# EAGLE design ORing_block (EAGLE 8.1.0)
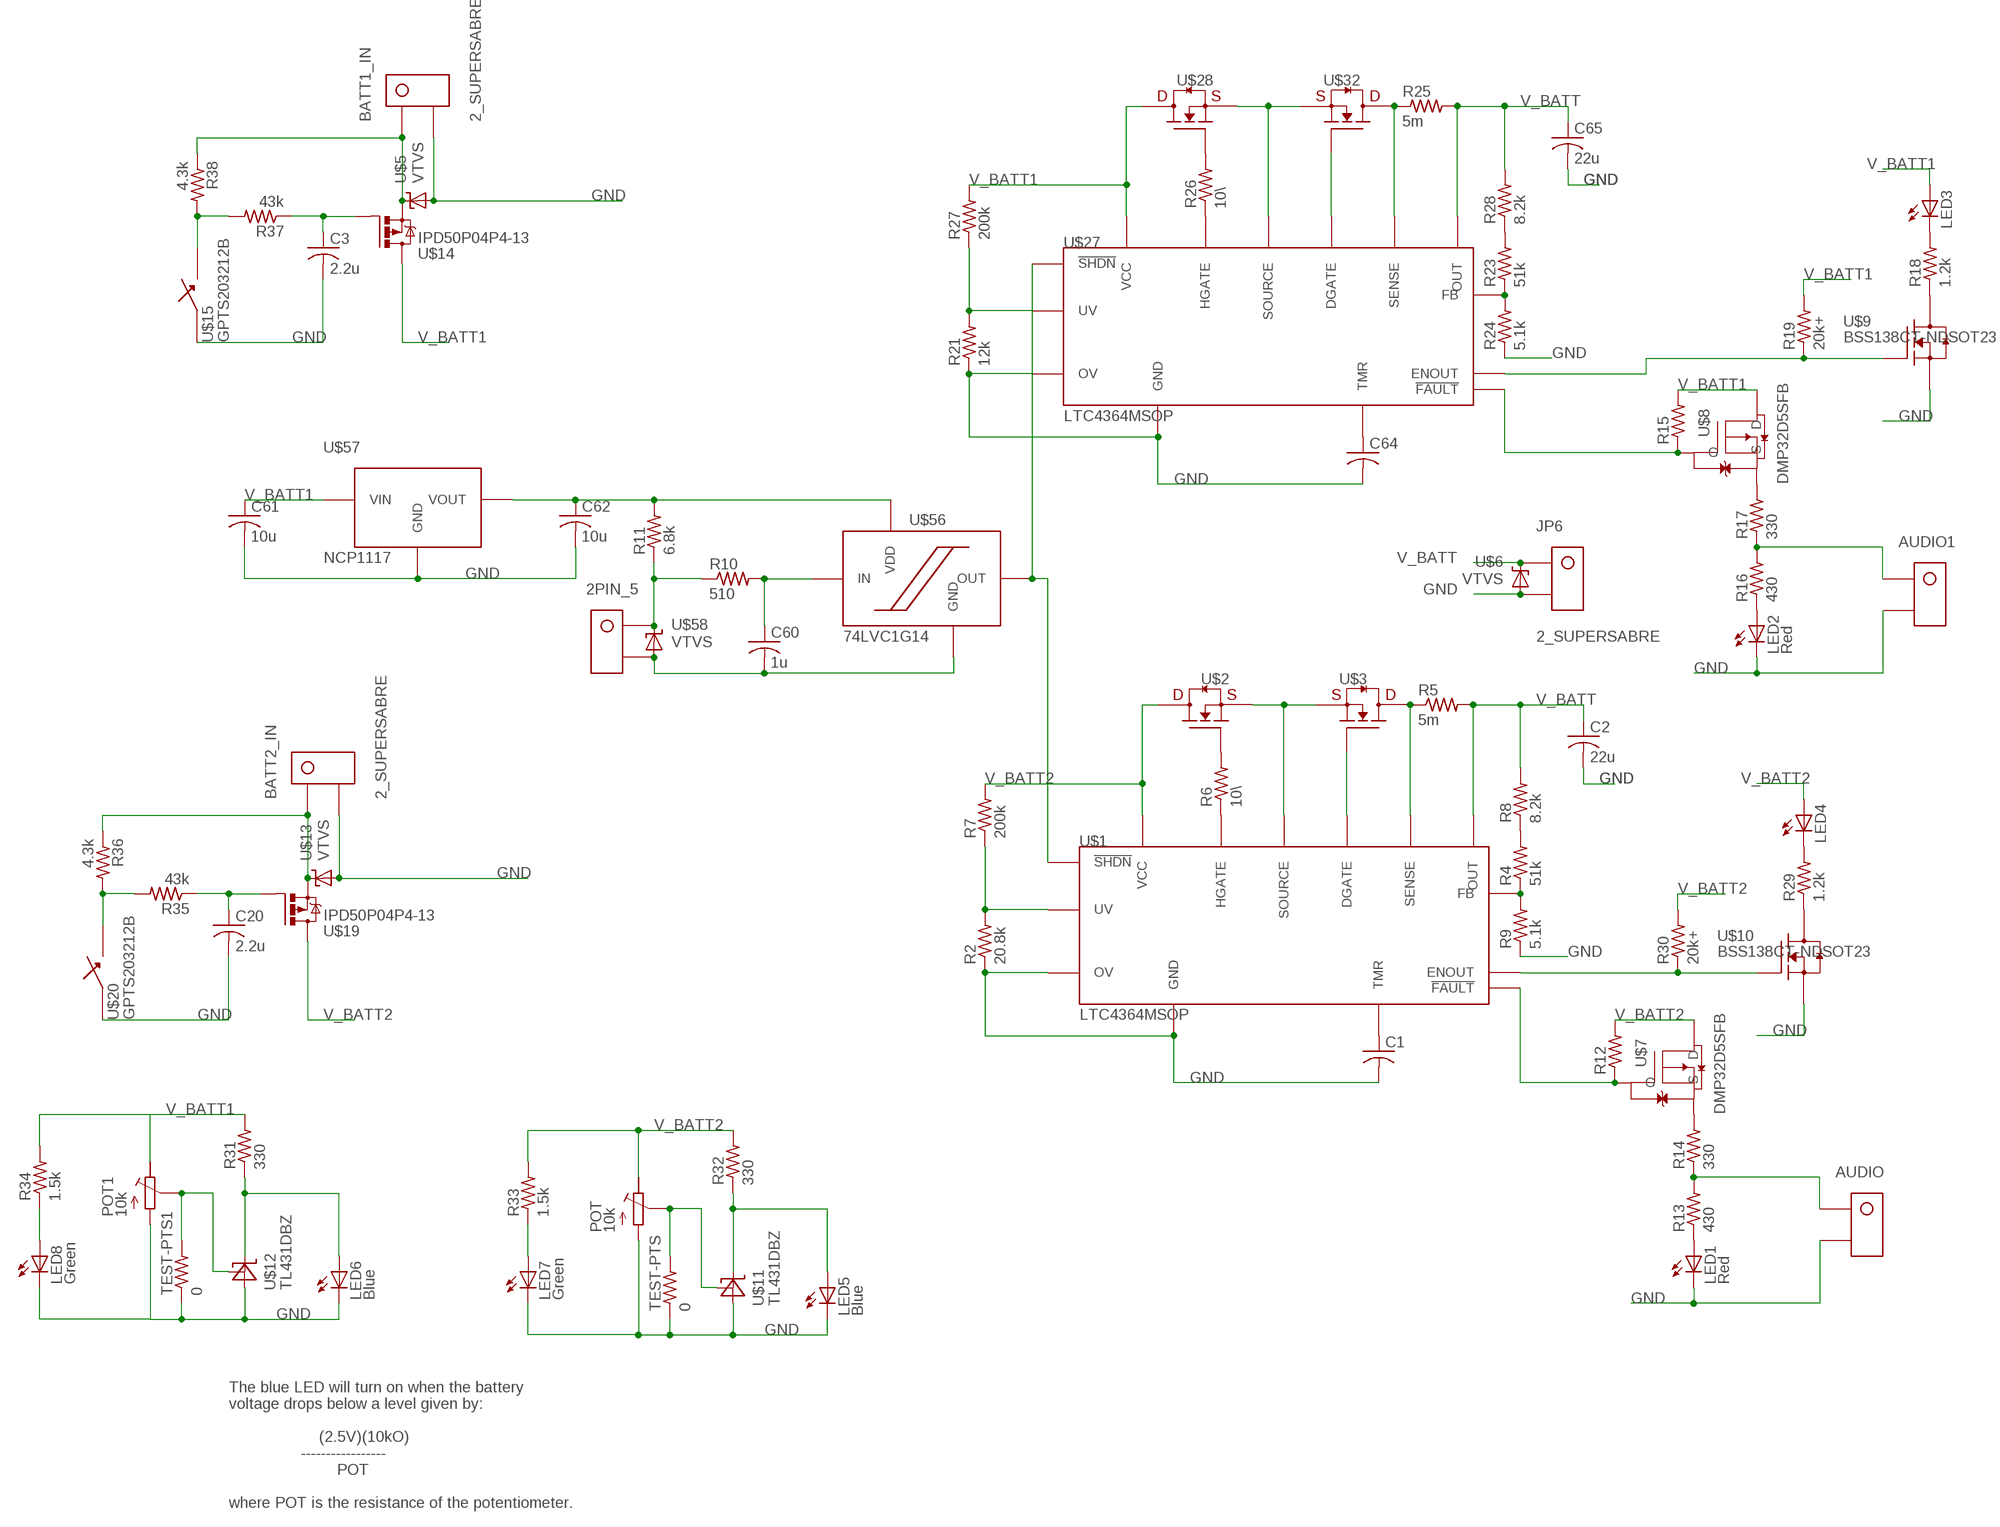
[diagram p0: schematic, sheet 1]

## Parts
2PIN_5  KK254_VERT_2PIN22-29-2021  [KK254_VERT_2PIN]
AUDIO  KK254_VERT_2PIN22-29-2021  [KK254_VERT_2PIN]
AUDIO1  KK254_VERT_2PIN22-29-2021  [KK254_VERT_2PIN]
BATT1_IN  2_SUPERSABRE  [SUPERSABRE_2CIRCUIT]
BATT2_IN  2_SUPERSABRE  [SUPERSABRE_2CIRCUIT]
C1  C-USC0805  [C0805]
C2  22u  C-USC0805  [C0805]
C3  2.2u  C-USC0805  [C0805]
C20  2.2u  C-USC0805  [C0805]
C60  1u  C-USC0805  [C0805]
C61  10u  C-USC0805  [C0805]
C62  10u  C-USC0805  [C0805]
C64  C-USC0805  [C0805]
C65  22u  C-USC0805  [C0805]
JP6  2_SUPERSABRE  [SUPERSABRE_2CIRCUIT]
LED1  Red  LEDCHIPLED_0805  [CHIPLED_0805]
LED2  Red  LEDCHIPLED_0805  [CHIPLED_0805]
LED3  LEDCHIPLED_0805  [CHIPLED_0805]
LED4  LEDCHIPLED_0805  [CHIPLED_0805]
LED5  Blue  0805_LED  [0805]
LED6  Blue  0805_LED  [0805]
LED7  Green  0805_LED  [0805]
LED8  Green  0805_LED  [0805]
POT  10k  R-TRIMMPTV09A-4  [PTV09A-4]
POT1  10k  R-TRIMMPTV09A-4  [PTV09A-4]
R2  20.8k  R-US_R0805  [R0805]
R4  51k  R-US_R0805  [R0805]
R5  5m  R-US_R0805  [R0805]
R6  10\  R-US_R0805  [R0805]
R7  200k  R-US_R0805  [R0805]
R8  8.2k  R-US_R0805  [R0805]
R9  5.1k  R-US_R0805  [R0805]
R10  510  R-US_R0805  [R0805]
R11  6.8k  R-US_R0805  [R0805]
R12  R-US_R0805  [R0805]
R13  430  R-US_R0805  [R0805]
R14  330  R-US_R0805  [R0805]
R15  R-US_R0805  [R0805]
R16  430  R-US_R0805  [R0805]
R17  330  R-US_R0805  [R0805]
R18  1.2k  R-US_R0805  [R0805]
R19  20k+  R-US_R0805  [R0805]
R21  12k  R-US_R0805  [R0805]
R23  51k  R-US_R0805  [R0805]
R24  5.1k  R-US_R0805  [R0805]
R25  5m  R-US_R0805  [R0805]
R26  10\  R-US_R0805  [R0805]
R27  200k  R-US_R0805  [R0805]
R28  8.2k  R-US_R0805  [R0805]
R29  1.2k  R-US_R0805  [R0805]
R30  20k+  R-US_R0805  [R0805]
R31  330  R-US_R0805  [R0805]
R32  330  R-US_R0805  [R0805]
R33  1.5k  R-US_R0805  [R0805]
R34  1.5k  R-US_R0805  [R0805]
R35  43k  R-US_R0805  [R0805]
R36  4.3k  R-US_R0805  [R0805]
R37  43k  R-US_R0805  [R0805]
R38  4.3k  R-US_R0805  [R0805]
TEST-PTS  0  R-US_V526-0  [V526-0]
TEST-PTS1  0  R-US_V526-0  [V526-0]
U$1  LTC4364MSOP  [MSOP16]
U$2  FDMC8360LET40PWR33  [POWER33]
U$3  FDMC8360LET40PWR33  [POWER33]
U$5  VTVS  [DO-219AB]
U$6  VTVS  [DO-219AB]
U$7  DMP32D5SFB  [AP02002]
U$8  DMP32D5SFB  [AP02002]
U$9  BSS138CT-NDSOT23  [SOT23]
U$10  BSS138CT-NDSOT23  [SOT23]
U$11  TL431DBZ  [SOT-23-3]
U$12  TL431DBZ  [SOT-23-3]
U$13  VTVS  [DO-219AB]
U$14  IPD50P04P4-13  [TO252-3]
U$15  GPTS203212B  [GPTS203211B]
U$19  IPD50P04P4-13  [TO252-3]
U$20  GPTS203212B  [GPTS203211B]
U$27  LTC4364MSOP  [MSOP16]
U$28  FDMC8360LET40PWR33  [POWER33]
U$32  FDMC8360LET40PWR33  [POWER33]
U$56  74LVC1G14  [TSSOP5]
U$57  NCP1117  [SOT-223]
U$58  VTVS  [DO-219AB]

## Nets
GND: AUDIO1.P$2 AUDIO.P$2 BATT1_IN.P$2 BATT2_IN.P$2 C1.2 C2.2 C3.2 C20.2 C61.2 C62.2 C64.2 C65.2 JP6.P$2 LED1.C LED2.C LED5.P$2(C) LED6.P$2(C) LED7.P$2(C) LED8.P$2(C) POT1.P$3(E) POT.P$3(E) R2.1 R9.1 R21.1 R24.1 TEST-PTS1.1 TEST-PTS.1 U$1.GND U$1.OV U$5.P$1(A) U$6.P$1(A) U$9.2(S) U$10.2(S) U$11.P$3(A) U$12.P$3(A) U$13.P$1(A) U$15.P$1 U$20.P$1 U$27.GND U$27.OV U$57.P$1(GND)
N$1: R2.2 R7.1 U$1.UV
N$3: R4.1 R9.2 U$1.FB
N$4: R6.1 U$1.HGATE
N$6: C1.1 U$1.TMR
N$7: R4.2 R8.1
N$8: R6.2 U$2.GATE
N$9: U$1.SOURCE U$2.SOURCE1(SOURCE) U$2.SOURCE2(SOURCE) U$2.SOURCE3(SOURCE) U$3.SOURCE1(SOURCE) U$3.SOURCE2(SOURCE) U$3.SOURCE3(SOURCE)
N$10: R5.1 U$1.SENSE U$3.DRAIN
N$11: U$1.DGATE U$3.GATE
N$12: 2PIN_5.P$1 R10.1 R11.1 U$58.P$2(C)
N$13: C62.1 R11.2 U$56.P$5(VDD) U$57.P$2(VOUT) U$57.P$4(VOUT)
N$14: U$1.SHDN(!SHDN!) U$27.SHDN(!SHDN!) U$56.P$4(OUT)
N$15: R14.2 U$7.P$1(S)
N$16: LED1.A R13.1
N$17: R12.1 U$1.FLT(!FAULT!) U$7.P$2(G)
N$18: AUDIO.P$1 R13.2 R14.1
N$19: LED2.A R16.1
N$20: R15.1 U$8.P$2(G) U$27.FLT(!FAULT!)
N$21: R17.2 U$8.P$1(S)
N$22: AUDIO1.P$1 R16.2 R17.1
N$23: POT.P$2(S) TEST-PTS.2 U$11.P$2(REF)
N$24: R18.1 U$9.3(D)
N$25: LED3.C R18.2
N$26: R29.1 U$10.3(D)
N$27: LED4.C R29.2
N$28: R30.1 U$1.ENOUT U$10.1(G)
N$29: R19.1 U$9.1(G) U$27.ENOUT
N$30: LED5.P$1(A) R32.1 U$11.P$1(C)
N$31: POT1.P$2(S) TEST-PTS1.2 U$12.P$2(REF)
N$32: LED6.P$1(A) R31.1 U$12.P$1(C)
N$33: LED7.P$1(A) R33.1
N$34: LED8.P$1(A) R34.1
N$35: C20.1 R35.1 U$19.1(G)
N$36: R35.2 R36.2 U$20.P$2
N$37: R26.1 U$27.HGATE
N$38: BATT1_IN.P$1 R38.1 U$5.P$2(C) U$14.TAB(D)
N$39: R21.2 R27.1 U$27.UV
N$40: C3.1 R37.1 U$14.1(G)
N$41: R37.2 R38.2 U$15.P$2
N$45: BATT2_IN.P$1 R36.1 U$13.P$2(C) U$19.TAB(D)
N$48: 2PIN_5.P$2 C60.2 U$56.P$3(GND) U$58.P$1(A)
N$49: C60.1 R10.2 U$56.P$2(IN)
N$50: R23.1 R24.2 U$27.FB
N$53: C64.1 U$27.TMR
N$54: U$27.SOURCE U$28.SOURCE1(SOURCE) U$28.SOURCE2(SOURCE) U$28.SOURCE3(SOURCE) U$32.SOURCE1(SOURCE) U$32.SOURCE2(SOURCE) U$32.SOURCE3(SOURCE)
N$57: R23.2 R28.1
N$59: R26.2 U$28.GATE
N$60: R25.1 U$27.SENSE U$32.DRAIN
N$61: U$27.DGATE U$32.GATE
V_BATT: C2.1 C65.1 JP6.P$1 R5.2 R8.2 R25.2 R28.2 U$1.OUT U$6.P$2(C) U$27.OUT
V_BATT1: C61.1 LED3.A POT1.P$1(A) R15.2 R19.2 R27.2 R31.2 R34.2 U$8.P$3(D) U$14.3(S) U$27.VCC U$28.DRAIN U$57.P$3(VIN)
V_BATT2: LED4.A POT.P$1(A) R7.2 R12.2 R30.2 R32.2 R33.2 U$1.VCC U$2.DRAIN U$7.P$3(D) U$19.3(S)

## Notes on the sheet
- The blue LED will turn on when the battery
  voltage drops below a level given by:
  
                      (2.5V)(10kO)
                  -----------------
                          POT
  
  where POT is the resistance of the potentiometer.

## Library data of the parts
2PIN_5 AUDIO AUDIO1 = molex:KK254_VERT_2PIN: KK® 254 Wire-to-Board Header, Vertical, with Friction Lock, 2 Circuits, Gold (Au) Plating Part Number: 22-29-2021 http://www.molex.com/molex/products/datasheet.jsp?part=active/0022292021_PCB_HEADERS.xml
BATT1_IN BATT2_IN JP6 = molex:2_SUPERSABRE: Molex SuperSabre 2-pin vertical header
C1-C3 C20 C60-C62 C64 C65 = resistor:C-US: CAPACITOR, American symbol
LED1-LED4 = led:LED: LED OSRAM: - CHIPLED LG R971, LG N971, LY N971, LG Q971, LY Q971, LO R971, LY R971 LH N974, LH R974 LS Q976, LO Q976, LY Q976 LO Q996 - Hyper CHIPLED LW Q18S LB Q993, LB Q99A, LB R99A - SideLED LS A670, LO A670, LY A670, LG A670, LP A670 LB A673, LV A673, LT A673, LW A673 LH A674 LY A675 LS A676, LA A676, LO A676, LY A676, LW A676 LS A679, LY A679, LG A679 - Hyper Micro SIDELED® LS Y876, LA Y876, LO Y876, LY Y876 LT Y87S - SmartLED LW L88C, LW L88S LB L89C, LB L89S, LG L890 LS L89K, LO L89K, LY L89K LS L896, LA L896, LO L896, LY L896 - TOPLED LS T670, LO T670, LY T670, LG T670, LP T670 LSG T670, LSP T670, LSY T670, LOP T670, LYG T670 LG T671, LOG T671, LSG T671 LB T673, LV T673, LT T673, LW T673 LH T674 LS T676, LA T676, LO T676, LY T676, LB T676, LH T676, LSB T676, LW T676 LB T67C, LV T67C, LT T67C, LS T67K, LO T67K, LY T67K, LW E67C LS E67B, LA E67B, LO E67B, LY E67B, LB E67C, LV E67C, LT E67C LW T67C LS T679, LY T679, LG T679 LS T770, LO T770, LY T770, LG T770, LP T770 LB T773, LV T773, LT T773, LW T773 LH T774 LS E675, LA E675, LY E675, LS T675 LS T776, LA T776, LO T776, LY T776, LB T776 LHGB T686 LT T68C, LB T68C - Hyper Mini TOPLED® LB M676 - Mini TOPLED Santana® LG M470 LS M47K, LO M47K, LY M47K Source: http://www.osram.convergy.de LUXEON: - LUMILED® LXK2-PW12-R00, LXK2-PW12-S00, LXK2-PW14-U00, LXK2-PW14-V00 LXK2-PM12-R00, LXK2-PM12-S00, LXK2-PM14-U00 LXK2-PE12-Q00, LXK2-PE12-R00, LXK2-PE12-S00, LXK2-PE14-T00, LXK2-PE14-U00 LXK2-PB12-K00, LXK2-PB12-L00, LXK2-PB12-M00, LXK2-PB14-N00, LXK2-PB14-P00, LXK2-PB14-Q00 LXK2-PR12-L00, LXK2-PR12-M00, LXK2-PR14-Q00, LXK2-PR14-R00 LXK2-PD12-Q00, LXK2-PD12-R00, LXK2-PD12-S00 LXK2-PH12-R00, LXK2-PH12-S00 LXK2-PL12-P00, LXK2-PL12-Q00, LXK2-PL12-R00 Source: www.luxeon.com KINGBRIGHT: KA-3528ASYC Source: www.kingbright.com
LED5-LED8 = led:0805_LED: LED, 0805 package. Any variety.
POT POT1 = resistor:R-TRIMM: Trimm resistor
R2 R4-R19 R21 R23-R38 TEST-PTS TEST-PTS1 = resistor:R-US_: RESISTOR, American symbol
U$1 U$27 = linear:LTC4364
U$2 U$3 U$28 U$32 = fairchild:FDMC8360LET40
U$5 U$6 U$13 U$58 = diode:VTVS: Vishay VTVS5V0ASMF to VTVS63GSMF 400W TVS diodes Datasheet <http://www.mouser.com/ds/2/427/vtvs5v0asmf-1078013.pdf>
U$7 U$8 = transistor-fet:DMP32D5SFB: Diodes Inc. DMP32D5SFB 30V P-MOSFET (Enhancement) Datasheet <http://www.mouser.com/ds/2/115/DMP32D5SFB-765036.pdf>
U$9 U$10 = transistor-fet:BSS138CT-ND: ON Semiconductor BSS138 N-MOSFET, Logic Level Datasheet <http://www.mouser.com/ds/2/149/BSS138-1006682.pdf>
U$11 U$12 = texas:TL431: Texas Instruments TL431 Adjustable shunt regulator Datasheet <http://www.ti.com/lit/ds/symlink/tl431.pdf>
U$14 U$19 = transistor-power:IPD50P04P4-13: Infineon IPD50P04P4-13 OptiMOS®-P2 Power-Transistor Datasheet <http://www.mouser.com/ds/2/196/Infineon-IPD50P04P4-13-DS-v01_02-EN-336147.pdf>
U$15 U$20 = switches:GPTS203212B: CW Industries Pushbutton SPST switch ON-OFF, 1A, 30VDC Datasheet <http://switches-connectors-custom.cwind.com/Asset/GPTS203211BR2.pdf>
U$56 = NXP:74LVC1G14: Nexperia 74LVC1G14 Single Schmitt trigger inverter Datasheet <http://www.mouser.com/ds/2/302/74LVC1G14_Q100-839654.pdf>
U$57 = ONSemi:NCP1117: ON Semiconductor NCP1117 5V 1A Fixed LDO Datasheet <http://www.mouser.com/ds/2/308/NCP1117-D-81326.pdf>

## Board
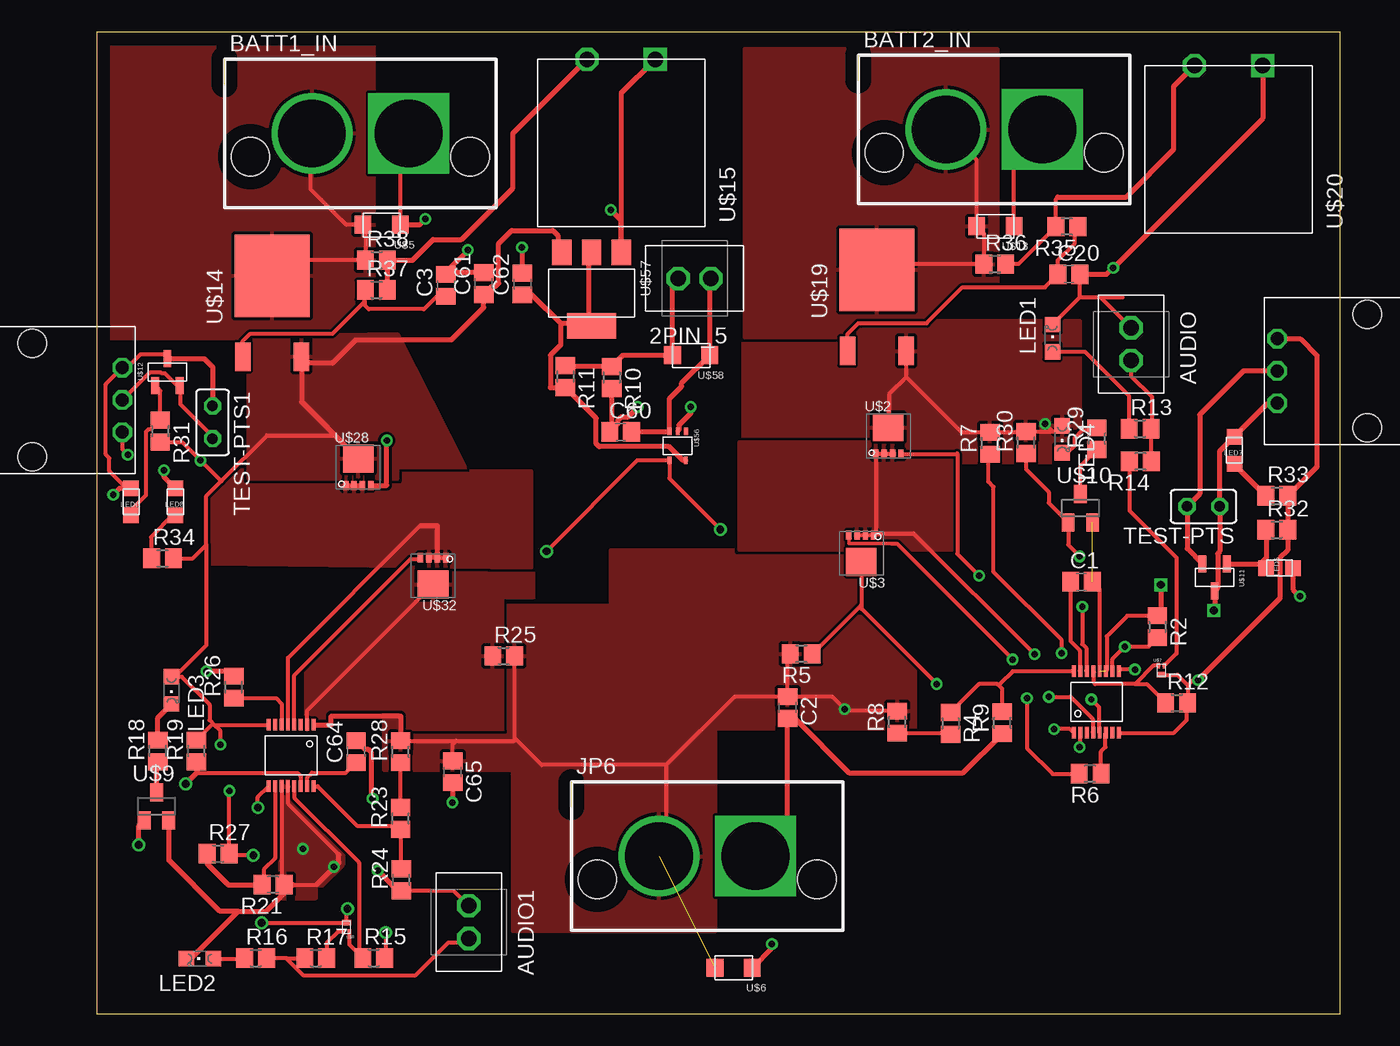
[diagram p1: board, top side]
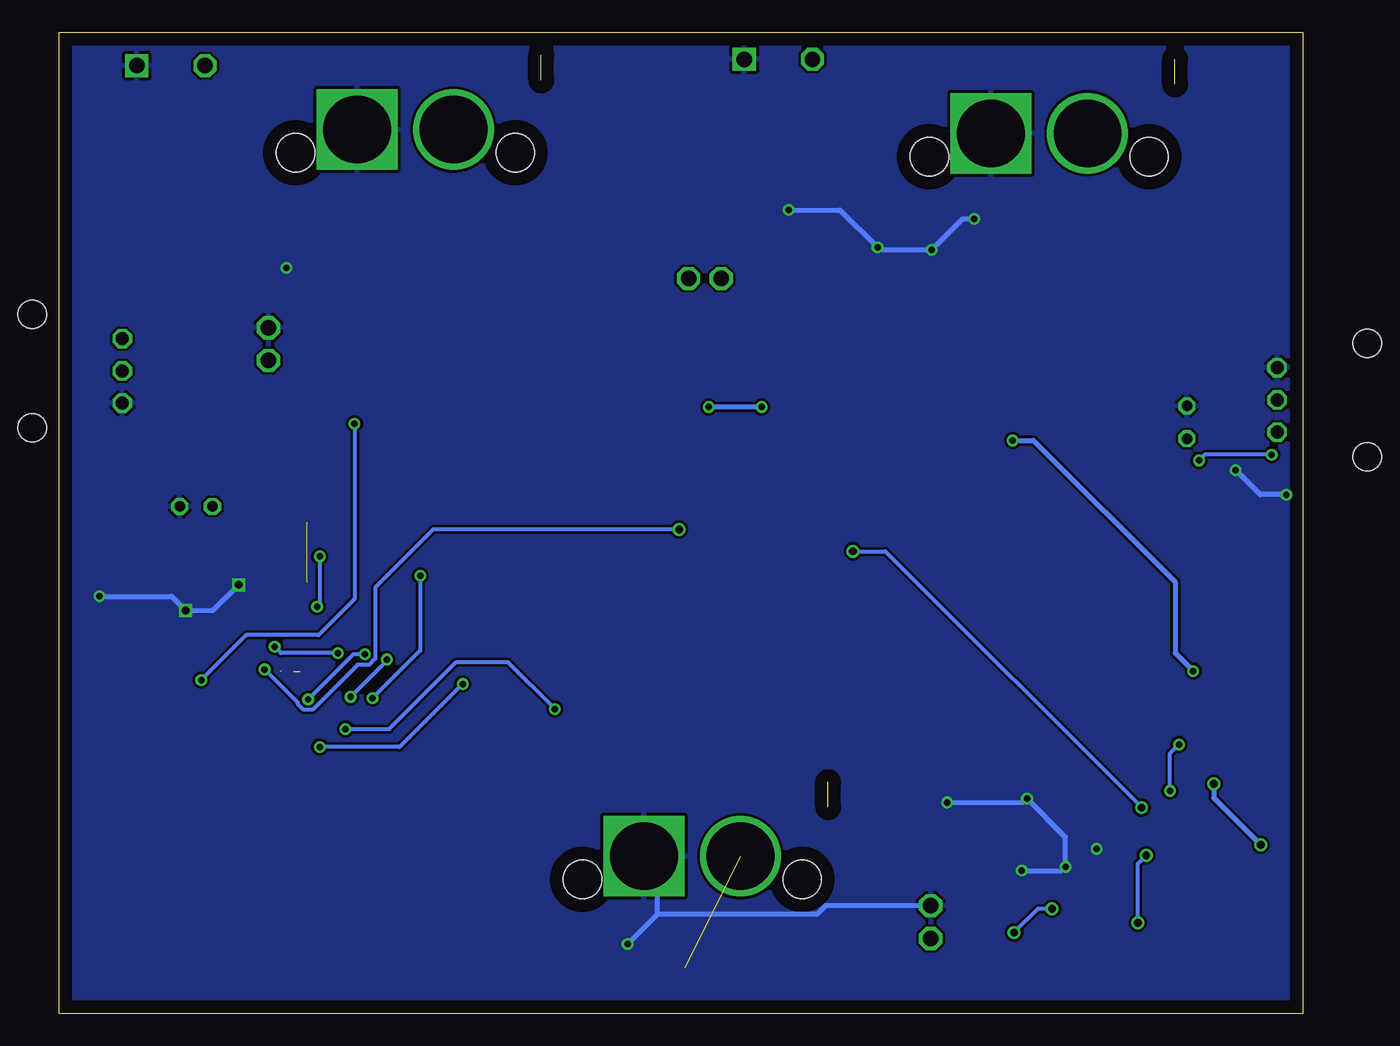
[diagram p2: board, bottom side, seen from below]

Size 96.52 x 76.2 mm. Coordinates in mm from the lower left corner, seen from the top.
Outline: 0,0 96.52,0 96.52,76.2 0,76.2 0,0
Copper layers (1*16): Top 0.035mm / dielectric 1.5mm / Bottom 0.035mm
Design rules "default": minimum track width 10mil, minimum drill 24mil, track to track 8mil, track to pad 8mil, pad to pad 8mil, via to via 8mil, smd to smd 8mil, copper to edge 40mil, drill to drill 8mil, minimum pad ring 10mil, minimum via ring 8mil, stop-mask expansion 4mil, vias tented up to drill 0mil, thermal gap 10mil

### Footprints (pad centres in the part's own frame; a part is rotated, then mirrored left to right if it is on the bottom)
KK254_VERT_2PIN = drill 1.2 octagon: P$1 1.27,0; P$2 -1.27,0
SUPERSABRE_2CIRCUIT = drill 5.25: P$1 -3.747,0 | drill 5.25 square: P$2 3.747,0 | hole 2.997: -8.534,-1.803; 8.534,-1.803
C0805 = smd 1.3 x 1.5: 1 -0.85,0; 2 0.85,0
CHIPLED_0805 = smd 1.2 x 1.2: A 0,-1.05; C 0,1.05
0805 = smd 1.2 x 1.2: P$1 -1.05,0; P$2 1.05,0
PTV09A-4 = drill 1 octagon: P$1 -2.5,0; P$2 0,0; P$3 2.5,0 | hole 2.2: -4.4,7; 4.4,7
R0805 = smd 1.3 x 1.5: 1 -0.85,0; 2 0.85,0
V526-0 = drill 0.813 octagon: 1 -1.27,0; 2 1.27,0
MSOP16 = smd 0.305 x 0.889: DGATE -0.25,-2.39; ENOUT -0.75,2.39; FB -1.75,2.39; FLT -0.25,2.39; GND 0.25,2.39; HGATE 0.75,-2.39; NC -0.75,-2.39; NC1 1.25,-2.39; OUT -1.75,-2.39; OV 0.75,2.39; SENSE -1.25,-2.39; SHDN 1.75,2.39; SOURCE 0.25,-2.39; TMR -1.25,2.39; UV 1.25,2.39; VCC 1.75,-2.39
POWER33 = smd 2.37 x 2.15: DRAIN 0,0.675 | smd 0.42 x 0.7: GATE 0.975,-1.4; SOURCE1 -0.975,-1.4; SOURCE2 -0.325,-1.4; SOURCE3 0.325,-1.4
DO-219AB = smd 1.3 x 1.4: P$1 -1.45,0; P$2 1.45,0
AP02002 = smd 0.4 x 0.25: P$1 -0.35,0.225; P$2 -0.35,-0.225 | smd 0.4 x 0.7: P$3 0.35,0
SOT23 = smd 1 x 1.4: 1 -0.95,-1.1; 2 0.95,-1.1; 3 0,1.1
SOT-23-3 = smd 1.3 x 0.6: P$1 -1.05,0.95; P$2 -1.05,-0.95; P$3 1.05,0
TO252-3 = smd 1.2 x 2.2: 1 -2.28,-6.3; 3 2.28,-6.3 | smd 5.8 x 6.4: TAB 0,0
GPTS203211B = drill 1.2 square: P$1 0,-2.65 | drill 1.2 octagon: P$2 0,2.65
TSSOP5 = smd 0.3 x 0.6: P$1 -0.65,-1.125; P$2 0,-1.125; P$3 0.65,-1.125; P$4 0.65,1.125; P$5 -0.62,1.125
SOT-223 = smd 1.5 x 2: P$1 -2.3,-3.15; P$2 0,-3.15; P$3 2.3,-3.15 | smd 3.8 x 2: P$4 0,2.54

### Placement (x,y rotation side)
2PIN_5  46.4,57.08 180 top
AUDIO  80.28,51.98 270 top
AUDIO1  28.87,7.11 270 top
BATT1_IN  20.45,68.35 0 top
BATT2_IN  69.65,68.65 0 top
C1  76.43,33.53 0 top
C2  53.62,23.77 270 top
C3  27.1,56.55 90 top
C20  75.45,57.4 0 top
C60  40.66,45.17 0 top
C61  30.03,56.68 90 top
C62  33.03,56.65 90 top
C64  20.12,20.35 90 top
C65  27.62,18.78 270 top
JP6  47.38,12.23 0 top
LED1  74.18,52.45 0 top
LED2  8,4.28 90 top
LED3  5.8,25.1 180 top
LED4  74.93,44.6 180 top
LED5  91.8,34.6 0 top
LED6  2.65,39.74 90 top
LED7  88.3,43.75 90 top
LED8  6.1,39.75 90 top
POT  91.62,49.9 270 top
POT1  1.98,47.65 90 top
R2  82.32,30.04 270 top
R4  66.27,22.54 270 top
R5  54.68,27.93 180 top
R6  77.1,18.63 180 top
R7  69.33,44.29 90 top
R8  62.13,22.64 90 top
R9  70.28,22.59 90 top
R10  39.97,49.39 270 top
R11  36.37,49.46 270 top
R12  83.82,24.13 0 top
R13  80.98,45.42 0 top
R14  81,42.88 180 top
R15  21.49,4.33 0 top
R16  12.32,4.32 0 top
R17  16.99,4.32 0 top
R18  4.73,20.39 90 top
R19  7.73,20.39 90 top
R21  13.68,10.02 180 top
R23  23.58,15.16 90 top
R24  23.63,10.39 90 top
R25  31.58,27.77 0 top
R26  10.63,25.35 90 top
R27  9.42,12.43 0 top
R28  23.58,20.34 90 top
R29  77.63,44.64 90 top
R30  72.13,44.34 90 top
R31  4.92,45.23 270 top
R32  91.59,37.57 0 top
R33  91.6,40.2 0 top
R34  5.1,35.35 0 top
R35  75.3,61.1 180 top
R36  69.7,58.2 0 top
R37  21.7,56.2 0 top
R38  21.7,58.5 0 top
TEST-PTS  85.9,39.38 180 top
TEST-PTS1  8.98,45.91 270 top
U$1  77.59,24.2 0 top
U$2  61.44,44.85 0 top
U$3  59.34,35.75 180 top
U$5  22.1,61.25 180 top
U$6  49.43,3.58 180 top
U$7  82.63,26.67 270 top
U$8  19.37,6.72 90 top
U$9  4.63,16.1 0 top
U$10  76.35,39.25 0 top
U$11  86.77,33.86 270 top
U$12  5.48,49.81 90 top
U$13  69.75,61.15 180 top
U$14  13.6,57.3 0 top
U$15  40.7,74.1 90 top
U$19  60.55,57.75 0 top
U$20  87.85,73.6 90 top
U$27  15.08,20.05 180 top
U$28  20.29,42.42 0 top
U$32  26.1,34 180 top
U$56  45.09,44.1 180 top
U$57  38.4,55.95 180 top
U$58  46.13,51.13 180 top

### Tracks (layer width: path | path; a pad name or v marks a point on that pad's centre or on a via)
GND  (via drill 0.5, 0.6)  (2 unrouted)
  Top 0.305: 18.78,12.37 14.85,16.3 14.85,17.64 U$27.GND | R24.1 27.71,9.54 AUDIO1.P$2 | U$5.P$1 23.55,67.7 BATT1_IN.P$2 | U$13.P$1 71.2,66.45 BATT2_IN.P$2 | 76.3,55.62 C20.2 | 76.3,55.62 LED1.C | 76.3,55.62 77.91,55.62 | 77.91,55.62 AUDIO.P$2 | 77.91,55.62 79.62,55.62 | 77.28,38.13 U$10.2 | U$1.GND 77.84,32.97 C1.2 | 82.14,31.07 R2.1 79.99,30.89 78.4,29.3 78.4,26.65 U$1.OV | U$27.OV 14.33,10.22 R21.1 15.2,10.02 17.07,10.02 | U$12.P$3 5.14,51.2 3.4,51.2 2.35,50.15 POT1.P$3 0.7,48.87 0.7,43.4 0.97,43.13 0.97,42.13 2.31,40.79 LED6.P$2
  Top 0.406: POT.P$3 90.9,47.4 LED7.P$2 87.17,43.67 TEST-PTS.1 87.17,35.88 87.01,35.73 87.01,33.05 U$11.P$3 86.77,31.37 v86.7,31.3 | v82.6,33.3 82.6,31.17 R2.1 | LED5.P$2 92.85,32.95 v93.4,32.4 | LED6.P$2 1.76,40.79 v1.27,40.3 | v5.2,42.2 5.2,41.7 LED8.P$2 | C64.2 20.76,20.56 21.04,20.56 21.28,20.32 21.28,16.82 v21.4,16.7 | C65.2 27.62,16.42 v27.6,16.4 | 18.78,11.78 18.78,12.37 | 18.78,11.78 v18.4,11.4 | 18.78,11.78 18.78,11.73 17.07,10.02 | v21.8,11.1 22.47,10.43 22.47,10.42 23.36,9.54 R24.1 | v52.4,5.4 52.4,5.1 U$6.P$1 | JP6.P$2 53.62,14.72 C2.2 54.18,22.92 58.4,18.7 67.24,18.7 R9.1 | C20.2 78.4,57.4 v78.9,57.9 90.5,69.5 U$20.P$1 | 15.2,10.02 13.14,7.96 10.96,7.96 | LED2.C 7.28,4.28 10.96,7.96 | 10.96,7.96 9.54,7.96 5.6,11.9 5.6,14.98 U$9.2 | U$12.P$3 8.34,50.86 9,50.2 9,47.2 TEST-PTS1.1 | U$15.P$1 40.7,71.45 U$57.P$1 40.7,61.6 v39.9,62.4 | v33,59.5 33,57.53 C62.2 | C61.2 27.23,57.53 | 27.23,57.53 C3.2 | 27.23,57.53 27.23,57.73 v28.8,59.3 | U$5.P$1 25.05,61.25 v25.5,61.7
  Bottom 0.406: v82.6,33.3 84.6,31.3 v86.7,31.3 87.8,32.4 v93.4,32.4 | v1.27,40.3 3.3,40.3 v5.2,42.2 | v27.6,16.4 21.7,16.4 v21.4,16.7 18.4,13.7 v18.4,11.4 18.7,11.1 v21.8,11.1 | AUDIO1.P$2 37.05,8.38 37.72,7.71 50.09,7.71 | v52.4,5.4 50.09,7.71 | 50.09,7.71 50.09,11.2 JP6.P$2 | v78.9,57.9 79,57.9 | v39.9,62.4 35.9,62.4 v33,59.5 32.8,59.3 v28.8,59.3 26.4,61.7 v25.5,61.7
  other vias: 16,12.8
  pour Top: 14.3,18 14.2,9 17,9 17,10 17.5,10 19.1,11.6 19.1,12.3 15,16.4 15,18
  pour Bottom: 0.2,76.2 0.2,0.1 95.8,0.1 95.8,76.2
N$1  (via drill 0.5)
  Top 0.305: R2.2 81.63,28.5 v79.8,28.5 78.84,27.54 U$1.UV | v74.9,28 74.9,29 69.6,34.3 69.6,40.9 69.2,41.3 69.2,43.31 R7.1
  Bottom 0.305: v74.9,28 79.3,28 v79.8,28.5
N$3
  Top 0.305: U$1.FB 71.09,26.59 70.1,25.6 69.9,25.6 | 69.9,25.6 68.48,25.6 R4.1 | R9.2 70.28,25.22 69.9,25.6
N$4
  Top 0.305: R6.1 77.95,20.35 78.3,20.7 78.3,21.77 U$1.HGATE
N$6
  Top 0.305: C1.1 75.58,28.92 76.3,28.2 76.3,26.63 U$1.TMR
N$7
  Top 0.305: R8.1 66.17,21.79 R4.2
N$8  (via drill 0.5)
  Top 0.305: U$2.GATE 66.75,43.45 66.8,43.5 66.8,35.7 v68.5,34 | v72.2,24.5 72.2,20.6 74.2,18.6 76.22,18.6 R6.2
  Bottom 0.305: v68.5,34 68.5,28.2 v72.2,24.5
N$9  (via drill 0.5)
  Top 0.305: U$2.SOURCE3 U$2.SOURCE2 U$2.SOURCE1 60.47,37.3 | 60.47,37.3 U$3.SOURCE1 U$3.SOURCE2 U$3.SOURCE3 | 60.47,37.3 63.4,37.3 v72.8,27.9 | v77.2,24.4 77.8,23.8 77.8,21.85 U$1.SOURCE
  Bottom 0.305: v72.8,27.9 73.7,27.9 v77.2,24.4
  pour Top: 49.9,44.4 68.6,44.4 68.6,36 49.9,36
N$10  (via drill 0.5)
  Top 0.305: U$3.DRAIN 59.34,31.74 | 59.34,31.74 R5.1 | 59.34,31.74 59.34,31.46 v65.2,25.6 | v76.3,20.7 76.34,20.74 U$1.SENSE
  Bottom 0.305: v65.2,25.6 70.1,20.7 v76.3,20.7
N$11  (via drill 0.5)
  Top 0.254: U$3.GATE 58.37,36.5 61.7,36.5
  Top 0.305: 61.7,36.5 62.1,36.5 v71.1,27.5 | v73.9,24.6 75.6,24.6 77.3,22.9 77.3,21.85 U$1.DGATE
  Bottom 0.305: v71.1,27.5 71.1,27.4 v73.9,24.6
N$12
  Top 0.406: R11.1 36.44,50.24 R10.1 40.86,51.13 U$58.P$2 44.68,56.63 2PIN_5.P$1
N$13
  Top 0.406: C62.1 33.8,55.8 36,53.6 | 36,53.6 38.21,53.6 | 38.21,53.6 U$57.P$4 | 38.21,53.6 38.21,58.91 U$57.P$2 | 36,53.6 36,51.91 35.21,51.13 35.21,48.61 35.2,48.6 R11.2 38.75,46.23 38.75,44.25 38.99,44.01 44.43,44.01 45.47,42.98 U$56.P$5
N$14  (via drill 0.5, 0.6)  (2 unrouted)
  Top 0.305: v34.9,35.9 41.98,42.98 U$56.P$4 44.44,41.56 v48.4,37.6 | v12.5,16 12.5,16.83 U$27.SHDN | v80.58,26.72 79.47,26.72 U$1.SHDN
  Bottom 0.305: v34.9,35.9 32.4,35.9 v12.5,16 | v80.58,26.72 78.01,24.15 78.01,24.07 77.53,23.59 76.86,23.59 73.36,27.09 72.47,27.09 71.99,27.57 71.99,33.09 67.48,37.6 v48.4,37.6
N$15
  Top 0.305: R14.2 80.15,39.05 83.8,35.4 83.8,27.96 U$7.P$1
N$16
  Top 0.305: LED1.A 76.7,51.4 80.1,48 80.1,45.45 R13.1
N$17
  Top 0.305: U$7.P$2 82.02,27.02 80.6,25.6 | 80.6,25.6 77.5,25.6 77.4,25.7 77.4,26.53 U$1.FLT | 80.6,25.6 81.5,25.6 R12.1
N$18
  Top 0.305: AUDIO.P$1 80.28,49.52 81.9,47.9 81.9,45.49 R13.2 81.85,45.4 R14.1
N$19
  Top 0.305: LED2.A 11.43,4.28 R16.1
N$20
  Top 0.305: U$8.P$2 19.59,5.38 R15.1 20.35,4.62 20.35,11.75 15.33,16.77 U$27.FLT
N$21
  Top 0.305: U$8.P$1 18.72,6.37 17.85,5.5 R17.2
N$22
  Top 0.305: R17.1 14.7,4.32 | 14.7,4.32 R16.2 | AUDIO1.P$1 28.87,5.52 27.27,5.52 24.7,2.95 16.07,2.95 14.7,4.32
N$23
  Top 0.406: POT.P$2 89,49.9 85.6,46.5 85.6,40.35 TEST-PTS.2 84.63,36.1 U$11.P$2
N$24
  Top 0.406: U$9.3 4.63,19.44 R18.1
N$25
  Top 0.406: R18.2 4.73,22.98 LED3.C
N$26
  Top 0.305: U$10.3 76.35,42.51 R29.1
N$27
  Top 0.305: LED4.C 75.35,43.55 75.9,44.1 75.9,44.7 76.5,45.3 77.44,45.3 R29.2
N$28  (via drill 0.5)
  Top 0.305: R30.1 72.13,42.27 73.9,40.5 73.9,39.65 U$10.1 75.4,36.4 v76.3,35.5 | v76.5,31.6 76.5,28.7 76.8,28.4 76.8,26.63 U$1.ENOUT
  Bottom 0.305: v76.3,35.5 76.3,31.8 v76.5,31.6
N$29  (via drill 0.6)
  Top 0.305: 7.73,18.68 15.57,18.68 15.8,18.45 15.8,17.69 U$27.ENOUT
  Top 0.406: R19.1 7.73,18.68 v6.9,17.85 | v3.25,13.1 3.25,14.57 U$9.1
  Bottom 0.406: v6.9,17.85 6.9,16.75 v3.25,13.1
N$30
  Top 0.406: U$11.P$1 90.44,34.91 | 90.44,34.91 LED5.P$1 | 90.44,34.91 90.44,35.04 90.8,35.4 90.8,37.51 R32.1
N$31
  Top 0.305: POT1.P$2 3.87,49.54 3.87,49.56 4.08,49.77 4.98,49.77 5.04,49.7 5.3,49.7 6.24,48.76 U$12.P$2 6.5,48.69 6.5,47.3 8.98,44.82 TEST-PTS1.2
N$32
  Top 0.305: U$12.P$1 4.92,48.37 R31.1 4.23,45.39 4.02,45.39 3.81,45.18 3.81,40.25 2.65,39.09 LED6.P$1
N$33
  Top 0.406: LED7.P$1 88.3,42.65 R33.1
N$34
  Top 0.305: LED8.P$1 5.9,38.7 4.2,37 4.2,35.4 R34.1
N$35
  Top 0.305: R35.1 75.9,60.85 75.9,59.8 74.6,58.5 C20.1 73.6,56.4 67.2,56.4 64.4,53.6 59.1,53.6 58.27,52.77 U$19.1
N$36
  Top 0.305: R36.2 71.55,58.2 R35.2 74.45,63.25 74.6,63.4
  Top 0.406: 74.6,63.4 79.9,63.4 83.6,67.1 83.6,72 U$20.P$2
N$37
  Top 0.305: R26.1 13.9,24.5 14.35,24.05 14.35,22.46 U$27.HGATE
N$38
  Top 0.305: U$14.TAB 14.8,58.5 R38.1 20.85,61.05 U$5.P$2 19.35,61.25 16.6,64 16.6,68.25 BATT1_IN.P$1
  pour Top (rank 2): 0,75.3 21.5,75.3 21.5,52.4 0,52.4
N$39
  Top 0.305: U$27.UV 13.83,12.08 12.95,11.2 12.95,10.14 R21.2 12.81,10.04
  Top 0.406: R27.1 8.57,11.63 10.2,10 12.81,10 R21.2
N$40
  Top 0.305: C3.1 26.4,55.7 25.4,54.7 21.1,54.7 20.8,55 20.8,55.3 | 20.8,55.3 20.8,56.15 R37.1 | U$14.1 11.32,52.22 11.9,52.8 18.3,52.8 20.8,55.3
N$41
  Top 0.406: R37.2 R38.2 24.5,58.5 26.1,60.1 28.3,60.1 32.3,64.1 32.3,68.35 U$15.P$2
N$45
  Top 0.305: BATT2_IN.P$1 68.3,66.25 U$13.P$2 68.85,60.6 R36.1 61,58.2 U$19.TAB
  pour Top: 50.3,74.9 69.9,74.9 69.9,52.5 50.3,52.5
N$48
  Top 0.406: C60.2 44.38,45.17 U$56.P$3 44.44,47.74 45.4,48.7 45.4,48.95 U$58.P$1 47.58,56.99 2PIN_5.P$2
N$49  (via drill 0.5)
  Top 0.406: R10.2 39.97,45.33 C60.1 40.45,45.81 40.45,46.09 40.69,46.33 41.23,46.33 v42,47.1 | U$56.P$2 45.18,45.32 45.18,45.69 46.1,46.61 v46.1,47.1
  Bottom 0.406: v42,47.1 v46.1,47.1
N$50
  Top 0.305: U$27.FB 17.14,17.66 20.2,14.6 23.29,14.6 R23.1 23.58,11.29 R24.2
N$53
  Top 0.305: U$27.TMR 16.33,18.33 16.7,18.7 19.32,18.7 C64.1
N$54
  Top 0.305: U$27.SOURCE 14.83,27.63 25.1,37.9
  Top 0.406: U$28.SOURCE1 U$28.SOURCE2 U$28.SOURCE3 | 25.1,37.9 26.43,37.9 U$32.SOURCE2 | U$32.SOURCE2 U$32.SOURCE3 | U$32.SOURCE2 U$32.SOURCE1
  pour Top (rank 2): 8.55,42.25 33.7,42.15 33.7,34.6 8.55,34.9
N$57
  Top 0.305: R23.2 R28.1
N$59  (via drill 0.5)
  Top 0.406: U$28.GATE 22.5,41.02 v22.5,44.5 | v8.5,26.6 10.23,26.6 R26.2
  Bottom 0.406: v22.5,44.5 20.9,44.5 9.9,33.5 9.9,28 v8.5,26.6
N$60
  Top 0.305: U$27.SENSE 16.33,23.55 U$32.DRAIN
  pour Top (rank 3): 33.9,34.6 16.2,34.6 16.2,22.1 31.5,22.1 31.5,32.35 33.9,32.35
N$61
  Top 0.305: U$27.DGATE 15.33,26.28 24.35,35.3 25.02,35.3 U$32.GATE
V_BATT  (via drill 0.5)  (1 unrouted)
  Top 0.305: 32.43,21.4 R25.2 | 32.43,21.4 32.43,21.19 27.9,21.19 | R28.2 27.9,21.19 | C65.1 27.62,20.91 27.9,21.19 | R8.2 58.21,23.49 v58.05,23.65 57.1,24.6 53.64,24.6 | 53.64,24.6 C2.1 53.62,27.72 R5.2 | U$1.OUT 75.55,22.1 v74.3,22.1 | 53.64,24.6 49.5,24.6 44.2,19.3 | 44.2,19.3 44.2,12.8 JP6.P$1 | 44.2,19.3 34.53,19.3 32.43,21.4
  Top 0.406: U$27.OUT 18.2,22.44 18.2,23.1 23.58,23.1 R28.2
  Bottom 0.305: v74.3,22.1 70.9,22.1 65.7,27.3 61.7,27.3 v58.05,23.65
  pour Top (rank 4): 22.3,31.7 39.9,31.7 39.9,36 63.5,36 63.5,22.1 48,22.1 48,6.4 32.3,6.4 32.3,18.9 22.3,18.9
V_BATT1  (via drill 0.5, 0.6)
  Top 0.305: 9.1,22.44 U$27.VCC | 9.1,22.44 8.93,22.44 R19.2 | 9.1,22.44 8.75,22.79 8.75,24 6.6,26.15 LED3.A 6.05,26.15 8.5,28.6 8.5,36.4 | v12.8,7.05 12.82,7.07 U$8.P$3 19.37,8.07 v19.45,8.15 | v12.15,12.3 10.4,12.3 R27.2 10.27,17.27 v10.3,17.3 | v22.4,6.3 22.4,4.39 R15.2 | v9.6,20.9 9.6,21.94 9.1,22.44 | 8.5,36.4 8.5,40.2 9.65,41.35 | 9.65,41.35 13.2,44.9 18.48,44.9 19.94,43.44 | R31.2 6.62,44.38 v8.05,42.95 9.65,41.35 | POT1.P$1 1.98,43.82 v2.4,43.4 | R34.2 7.45,35.35 8.5,36.4
  Top 0.406: U$28.DRAIN 19.94,43.44 15.88,47.51 U$14.3 16.38,50.5 18.3,50.5 20.1,52.3 27.5,52.3 30.03,54.83 C61.1 30.67,56.47 30.95,56.47 31.19,56.71 31.19,59.79 32.2,60.8 35.4,60.8 35.8,60.4 35.8,59.4 U$57.P$3
  Bottom 0.305: v12.8,7.05 12.8,11.65 v12.15,12.3 | v19.45,8.15 20.55,8.15 v22.4,6.3 | v10.3,17.3 10.3,20.2 v9.6,20.9 | v2.4,43.4 7.6,43.4 v8.05,42.95
  pour Top: 28.6,42.4 23.3,42.4 23.3,41.5 11.8,41.5 11.8,52.6 23.3,52.8
V_BATT2  (via drill 0.5)
  Top 0.305: 62.83,49.43 U$19.3 | 62.83,49.43 61.5,48.1 61.5,45.59 U$2.DRAIN | 62.83,49.43 67.12,45.14 R7.2 72.08,45.14 R30.2 74.21,45.19 | LED4.A 74.47,45.19 74.21,45.19 | U$7.P$3 83.88,26.32 84.7,25.5 | 84.7,25.5 84.7,24.16 R12.2 84.6,24.06 84.6,22.8 83.61,21.81 U$1.VCC | 74.21,45.19 v73.6,45.8 | v85.5,25.9 85.1,25.9 84.7,25.5
  Top 0.406: v85.5,25.9 91.84,32.24 91.84,35.37 92.44,35.97 R32.2 R33.2 94.7,42.45 94.7,51.1 93.4,52.4 POT.P$1
  Bottom 0.305: v73.6,45.8 73.6,32.2 76.4,29.4 82,29.4 v85.5,25.9
  pour Top (rank 2): 50.2,53.8 76.3,53.8 76.3,42.8 50.2,42.8